# Altium schematic sheet Optical Switch PCB.SchDoc
size A4
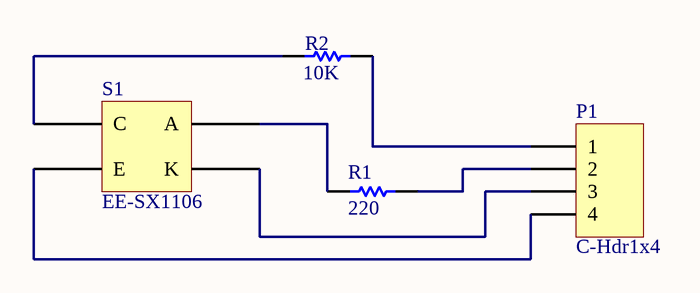
[diagram p0: Optical Switch PCB.SchDoc]

## Parts
P1  C-Hdr1x4  [HDR1X4_LGE1.0]
R1  220  [AXIAL-0.3]
R2  10K  [AXIAL-0.3]
S1  EE-SX1106  [S-OptSw]

## Nets
NetP1_1: P1.1 R2.2
NetP1_2: P1.2 R1.2
NetP1_3: P1.3 S1.K
NetP1_4: P1.4 S1.E
NetR1_1: R1.1 S1.A
NetR2_1: R2.1 S1.C

## Library data of the parts
P1 = C-Hdr1x4: Header, 4-Pin; LatestRevisionDate: 17-Jul-2002; LatestRevisionNote: Re-released for DXP Platform.; Publisher: Altium Limited
R1 R2 = Res1: Resistor; Published: 8-Jun-2000; LatestRevisionDate: 17-Jul-2002; LatestRevisionNote: Re-released for DXP Platform.; PackageReference: AXIAL-0.3; Publisher: Altium Limited; PackageDescription: Axial Device, Thru-Hole; 2 Leads; 0.3 in Pin Spacing
  R1: Value: 220
  R2: Value: 10K
S1 = S-OptSw: Optical Switch